# Altium schematic sheet DigitalLabBoard_Processor.SchDoc
size A4
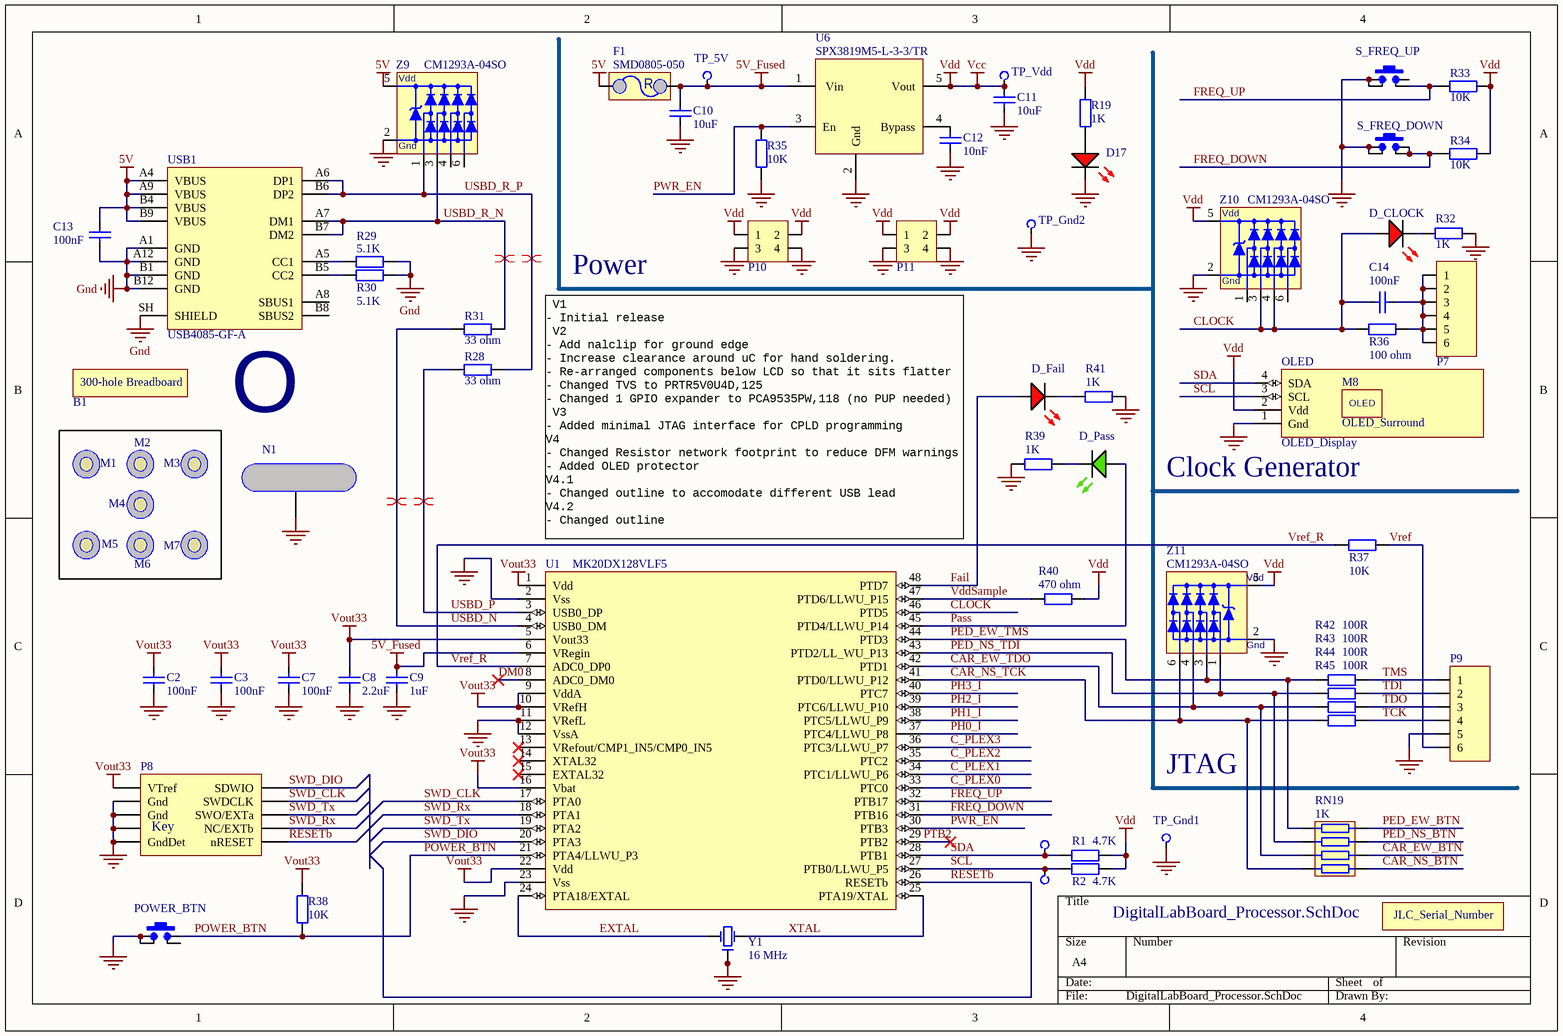
[diagram p0: DigitalLabBoard_Processor.SchDoc]

## Parts
B1  Breadboard - 300 Hole  [Breadboard - 300 holes]  (value not drawn)
C2  100nF  [CCNP1608-0603]
C3  100nF  [CCNP1608-0603]
C7  100nF  [CCNP1608-0603]
C8  2.2uF  [CCNP1608-0603]
C9  1uF  [CCNP1608-0603]
C10  10uF  [CCNP2012-0805]
C11  10uF  [CCNP2012-0805]
C12  10nF  [CCNP1608-0603]
C13  100nF  [CCNP1608-0603]
C14  100nF  [CCNP1608-0603]
D17  LED Red  [LED1608-0603-RED]  (value not drawn)
D_CLOCK  LED Red  [LED1608-0603-RED]  (value not drawn)
D_Fail  LED Red  [LED1608-0603-RED]  (value not drawn)
D_Pass  LED Green  [LED1608-0603-GREEN]  (value not drawn)
F1  SMD0805-050  [SMD0805-050]
JLC_Serial_Number  JLC_Serial_Number  [JLC_Serial_Number]  (value not drawn)  (no BOM)
Logo  OSHW Logo  [OSHW]  (value not drawn)  (no BOM)
M1  Plastic Bumper  [Bumper_RBS-2]  (value not drawn)
M2  Plastic Bumper  [Bumper_RBS-2]  (value not drawn)
M3  Plastic Bumper  [Bumper_RBS-2]  (value not drawn)
M4  Plastic Bumper  [Bumper_RBS-2]  (value not drawn)
M5  Plastic Bumper  [Bumper_RBS-2]  (value not drawn)
M6  Plastic Bumper  [Bumper_RBS-2]  (value not drawn)
M7  Plastic Bumper  [Bumper_RBS-2]  (value not drawn)
M8  OLED_Surround  [OLED_Surround]
N1  Gnd  [Nalclip-Edge]  (value not drawn)  (no BOM)
OLED  OLED_Display  [OLED_Display_128x32]
P7  Header 2x3  [HDR2X3S]  (value not drawn)
P8  SWD Connector 2x5-Pin  [SWD-2x5-Jig-Pads]  (value not drawn)  (no BOM)
P9  Header, 6-Pin  [HDR1X6S]  (value not drawn)
P10  Header 2x2  [HDR2X2S]  (value not drawn)
P11  Header 2x2  [HDR2X2S]  (value not drawn)
POWER_BTN  SMD-SW-4_5.1x5.1x2.0_M  [SMD-SW-4_5.1x5.1x2.0_M]  (value not drawn)
R1  4.7K  [CR1608-0603]
R2  4.7K  [CR1608-0603]
R19  1K  [CR1608-0603]
R28  value 33 ohm  [CR1608-0603]  (hidden comment: 33R)
R29  5.1K  [CR1608-0603]
R30  5.1K  [CR1608-0603]
R31  value 33 ohm  [CR1608-0603]  (hidden comment: 33R)
R32  1K  [CR1608-0603]
R33  10K  [CR1608-0603]
R34  10K  [CR1608-0603]
R35  10K  [CR1608-0603]
R36  value 100 ohm  [CR1608-0603]  (hidden comment: 100R)
R37  10K  [CR1608-0603]
R38  10K  [CR1608-0603]
R39  1K  [CR1608-0603]
R40  value 470 ohm  [CR1608-0603]  (hidden comment: 470R)
R41  1K  [CR1608-0603]
R42  100R  [CR1608-0603]
R43  100R  [CR1608-0603]
R44  100R  [CR1608-0603]
R45  100R  [CR1608-0603]
RN19  1K  [CR1206-0603_X4_N]
S_FREQ_DOWN  SMD-SW-4_5.1x5.1x3.5_M  [SMD-SW-4_5.1x5.1x3.5_M]  (value not drawn)
S_FREQ_UP  SMD-SW-4_5.1x5.1x3.5_M  [SMD-SW-4_5.1x5.1x3.5_M]  (value not drawn)
TP_5V  5V  [PCBPIN - 0.9mm]  (value not drawn)  (no BOM)
TP_Gnd1  Gnd  [PCBPIN - 0.9mm]  (value not drawn)  (no BOM)
TP_Gnd2  Gnd  [PCBPIN - 0.9mm]  (value not drawn)  (no BOM)
TP_SCL  SCL  [PCBPIN - 0.9mm]  (value not drawn)  (no BOM)
TP_SDA  SDA  [PCBPIN - 0.9mm]  (value not drawn)  (no BOM)
TP_Vdd  Vdd  [PCBPIN - 0.9mm]  (value not drawn)  (no BOM)
U1  MK20DX128VLF5  [TSQFP50P900X900-48M]
U6  SPX3819M5-L-3-3/TR  [SOT-23-5_L]
USB1  USB4085-GF-A  [USB4085-GF-A]
Y1  16 MHz  [Crystal_SMD_3.2x2.5]
Z9  CM1293A-04SO  [SOT457_N]
Z10  CM1293A-04SO  [SOT457_N]
Z11  CM1293A-04SO  [SOT457_N]

## Nets
5V: C13.2 F1.1 USB1.A4(VBUS) USB1.A9(VBUS) USB1.B4(VBUS) USB1.B9(VBUS) Z9.5(Vp)
5V_Fused: C9.2 C10.2 F1.2 TP_5V.1(TP) U1.6(VRegin) U6.1(Vin)
GND: C2.1 C3.1 C7.1 C8.1 C9.1 C10.1 C11.1 C12.1 C13.1 D17.K N1.1 OLED.1(Gnd) P8.0(Pins) P8.3(Gnd) P8.5(Gnd) P8.9(GndDet) P9.5 P10.3 P10.4 P11.3 P11.4 POWER_BTN.2 POWER_BTN.2b R29.2 R30.2 R32.2 R35.1 R39.1 R41.1 S_FREQ_DOWN.1 S_FREQ_DOWN.1b S_FREQ_UP.1 S_FREQ_UP.1b TP_Gnd1.1(TP) TP_Gnd2.1(TP) U1.2(Vss) U1.11(VRefL) U1.12(VssA) U1.23(Vss) U6.2(Gnd) USB1.A1(GND) USB1.A12(GND) USB1.B1(GND) USB1.B12(GND) USB1.SH(SHIELD) Y1.2(Gnd) Y1.4(Gnd) Z9.2(Vn) Z10.2(Vn) Z11.2(Vn)
Vcc: C11.2 OLED.2(Vdd) P10.1 P10.2 P11.1 P11.2 R1.2 R2.2 R19.2 R33.2 R34.2 R40.1 TP_Vdd.1(TP) U6.5(Vout) Z10.5(Vp) Z11.5(Vp)  [also labelled Vdd]
Vout33: C2.2 C3.2 C7.2 C8.2 P8.1(VTref) R38.1 U1.1(Vdd) U1.5(Vout33) U1.9(VddA) U1.10(VRefH) U1.16(Vbat) U1.22(Vdd)
C_PLEX0: U1.33(PTC0)
C_PLEX1: U1.34(PTC1/LLWU_P6)
C_PLEX2: U1.35(PTC2)
C_PLEX3: U1.36(PTC3/LLWU_P7)
CAR_EW_BTN: RN19.6
CAR_EW_TDO: R44.1 RN19.3 U1.42(PTD1) Z11.4
CAR_NS_BTN: RN19.5
CAR_NS_TCK: R45.1 RN19.4 U1.41(PTD0/LLWU_P12) Z11.6
CLOCK: C14.2 D_CLOCK.A R36.2 U1.46(PTD5) Z10.3 Z10.4
DM0: U1.8(ADC0_DM0)
EXTAL: U1.24(PTA18/EXTAL) Y1.3(OSC2)
Fail: D_Fail.A U1.48(PTD7)
FREQ_DOWN: R34.1 S_FREQ_DOWN.2 S_FREQ_DOWN.2b U1.31(PTB16)
FREQ_UP: R33.1 S_FREQ_UP.2 U1.32(PTB17)
Pass: D_Pass.A U1.45(PTD4/LLWU_P14)
PED_EW_BTN: RN19.8
PED_EW_TMS: R42.1 RN19.1 U1.44(PTD3) Z11.3
PED_NS_BTN: RN19.7
PED_NS_TDI: R43.1 RN19.2 U1.43(PTD2/LL_WU_P13) Z11.1
PH0_I: U1.37(PTC4/LLWU_P8)
PH1_I: U1.38(PTC5/LLWU_P9)
PH2_I: U1.39(PTC6/LLWU_P10)
PH3_I: U1.40(PTC7)
POWER_BTN: POWER_BTN.1b R38.2 U1.21(PTA4/LLWU_P3)
PTB2: U1.29(PTB2)
PWR_EN: R35.2 U1.30(PTB3) U6.3(En)
RESETb: P8.10(nRESET) U1.26(RESETb)
SCL: OLED.3(SCL) R2.1 TP_SCL.1(TP) U1.27(PTB0/LLWU_P5)
SDA: OLED.4(SDA) R1.1 TP_SDA.1(TP) U1.28(PTB1)
SWD_CLK: P8.4(SWDCLK) U1.17(PTA0)
SWD_DIO: P8.2(SDWIO) U1.20(PTA3)
SWD_Rx: P8.8(NC/EXTb) U1.18(PTA1)
SWD_Tx: P8.6(SWO/EXTa) U1.19(PTA2)
TCK: P9.4 R45.2
TDI: P9.2 R43.2
TDO: P9.3 R44.2
TMS: P9.1 R42.2
USBD_N: R31.2 U1.4(USB0_DM)
USBD_P: R28.2 U1.3(USB0_DP)
USBD_R_N: R31.1 USB1.A7(DM1) USB1.B7(DM2) Z9.3
USBD_R_P: R28.1 USB1.A6(DP1) USB1.B6(DP2) Z9.1
VddSample: R40.2 U1.47(PTD6/LLWU_P15)
Vref: P9.6 R37.2
Vref_R: R37.1 U1.7(ADC0_DP0)
XTAL: U1.25(PTA19/XTAL) Y1.1(OSC1)
NetC12_2: C12.2 U6.4(Bypass)
NetC14_1: C14.1 P7.1 P7.2 P7.3 P7.4 P7.5 P7.6 R36.1
NetD17_A: D17.A R19.1
NetD_CLOCK_K: D_CLOCK.K R32.1
NetD_Fail_K: D_Fail.K R41.2
NetD_Pass_K: D_Pass.K R39.2
NetR29_1: R29.1 USB1.A5(CC1)
NetR30_1: R30.1 USB1.B5(CC2)

Not connected (* = marked no-connect by the designer): POWER_BTN 1; S_FREQ_UP 2b; U1 13(VRefout/CMP1_IN5/CMP0_IN5)* 14(XTAL32)* 15(EXTAL32)*; USB1 A8(SBUS1) B8(SBUS2); Z9 4 6; Z10 1 6

## Layout directives
differential pair: USBD_N, USBD_P, USBD_R_N, USBD_R_P

## Notes on the sheet
- Power
- (near OLED) Clock Generator
- V1
  - Initial release
  V2
  - Add nalclip for ground edge
  - Increase clearance around uC for hand soldering.
  - Re-arranged components below LCD so that it sits flatter
  - Changed TVS to PRTR5V0U4D,125
  - Changed 1 GPIO expander to PCA9535PW,118 (no PUP needed)
  V3
  - Added minimal JTAG interface for CPLD programming
  V4
  - Changed Resistor network footprint to reduce DFM warnings
  - Added OLED protector
  V4.1
  - Changed outline to accomodate different USB lead
  V4.2
  - Changed outline
- JTAG
- (in symbol Breadboard - 300 holes) 300-hole Breadboard
- (in symbol CM1293A-04SO) Vdd; Gnd
- (in symbol OLED_Surround) OLED
- (in symbol OSHW Logo) O
- (in symbol SMD0805-050) R
- (in symbol SWD2X5_JIG) Key

## Library data of the parts
B1 = Breadboard - 300 holes
C2 C3 C7 C13 C14 = Cap_CCNP_0603: Capacitor non-polar SMT 0603; Manufacturer: Generic Components; Class: Passive; Published: 08/06/2000; Publisher: Altium Hobart Technology Centre; SubClass: Capacitor; Farnell PN: *; Digikey: *; Value: 100nF; LCSC: C14663
C8-C12 = Cap: Capacitor; Manufacturer: Generic Components; Class: Passive; Published: 08/06/2000; Publisher: Altium Hobart Technology Centre; SubClass: Capacitor; Farnell PN: *; Digikey: *
  C8: Value: 2.2uF; LCSC: C23630
  C9: Value: 1uF; LCSC: C15849
  C10 C11: Value: 10uF; LCSC: C15850
  C12: Value: 10nF; LCSC: C57112
D17 D_CLOCK D_Fail = LED-0603-Red: LED 0603 Red; Manufacturer: Generic Components; Class I: Optoelectronic; Published: 8-Jun-2000; Revision: July-2002: Re-released for DXP Platform.; Publisher: Altium Limited; Class II: LED; Farnell PN: 1581239; Digikey: *; LCSC: C2286
D_Pass = LED-0603-Green: LED 0603 Green; Manufacturer: Generic Components; Class I: Optoelectronic; Published: 8-Jun-2000; Revision: July-2002: Re-released for DXP Platform.; Publisher: Altium Limited; Class II: LED; Farnell PN: 1581242; Digikey: *; LCSC: C72043
F1 = SMD0805-050: PTC Resetable Fuse 0805 0.5A hold; LCSC: C66452
M1-M7 = Mounting_Feet: Plastic bumper/foot; Digikey: RPC4821-ND; Farnell PN: 1800864; LCSC: *
N1 = Nalclip-Edge
OLED = OLED_Display: OLED Display 128x32 pixels, I2C interface; LCSC: *
P8 = SWD2X5_JIG: LatestRevisionDate: 17-Jul-2002; LatestRevisionNote: Re-released for DXP Platform.; Publisher: Altium Limited; Farnell PN: 1865285; LCSC: *
P9 = Header 1x6: LatestRevisionDate: 17-Jul-2002; LatestRevisionNote: Re-released for DXP Platform.; Publisher: Altium Limited; LCSC: *; Farnell PN: 1835481; Digikey: 609-3272-ND
POWER_BTN S_FREQ_DOWN S_FREQ_UP = SW_PB-TS: Tactile Switch SPST 5.10mm X 5.10mm / (1.5mm=C318884) / (2.0mm=C318888) / (3.5mm=C318886); Revision: 1.0
  POWER_BTN: LCSC: C318888
  S_FREQ_DOWN S_FREQ_UP: LCSC: C318886
R1 R2 R19 R28-R45 = Res_CR0603: Resistor SMT 0603; Manufacturer: Generic Components; Class: Passive; Published: 08/06/2000; Publisher: Altium Hobart Technology Centre; SubClass: Resistor; Farnell PN: *; Digikey: *
  R1 R2: Value: 4.7K; LCSC: C23162
  R19 R32 R39 R41: Value: 1K; LCSC: C21190
  R28 R31: LCSC: C23140
  R29 R30: Value: 5.1K; LCSC: C23186
  R33-R35 R37 R38: Value: 10K; LCSC: C25804
  R36: LCSC: C22775
  R40: LCSC: C23179
  R42-R45: LCSC: C22775; Value: 100R
RN19 = ResistorNetwork_CR0603x4: SMT x4 Resistor Array; Farnell PN: *; Digikey: *; Value: 1K; LCSC: C20197
TP_5V TP_Gnd1 TP_Gnd2 TP_SCL TP_SDA TP_Vdd = TP: Test Point; Digikey: *; Farnell PN: *
U1 = MK20DX128VLF5: Kinetis K20: 50MHz Cortex-M4 Performance MCU, 160KB Flash, 16KB SRAM, Full-Speed USB, 48-LQFP; Farnell PN: 2133571; Digikey: MK20DX128VLF50-ND; Mouser: 841-MK20DX128VLF5
U6 = SPX3819M5-L-3-3/TR: 3.3V LDO with enable; LCSC: C9055; Farnell PN: 2889625; Digikey: 1016-1873-1-ND
USB1 = USB4085-GF-A: USB-C, USB 2.0 Receptacle Connector 16 Position Through Hole, Right Angle; Angle: 90; Part Number: USB4085-GF-A; Digikey Part Number: 2073-USB4085-GF-ACT-ND; Digikey Link: https://www.digikey.ee/product-detail/en/gct/USB4085-GF-A/2073-USB4085-GF-ACT-ND/9859733; Farnell PN: 2924867; Digikey: 2073-USB4085-GF-ACT-ND; LCSC: *
Y1 = Crystal 16MHz: Crystal SMD 3.2 x 2.5 x 0.7 mm; Manufacturer: Generic Components; Class: Oscillator; SubClass: Crystal Oscillator; Published: 08/06/2000; Publisher: Altium Hobart Technology Centre; Digikey: *; Farnell PN: *; LCSC: C13738
Z9-Z11 = CM1293A-04SO: Ultra low capacitance quadruple rail-to-rail ESD protection; Farnell PN: 2533258; Digikey: CM1293A-04SOOSCT-ND; LCSC: C393377
M8 = OLED_Surround: Digikey: RPC4821-ND; Farnell PN: 1800864
P7 = Header 2x3: LCSC: *; Farnell PN: 2886106; Digikey: 609-5700-ND
P10 P11 = Header 2x2: LCSC: *; Farnell PN: 1622403; Digikey: 609-5699-ND